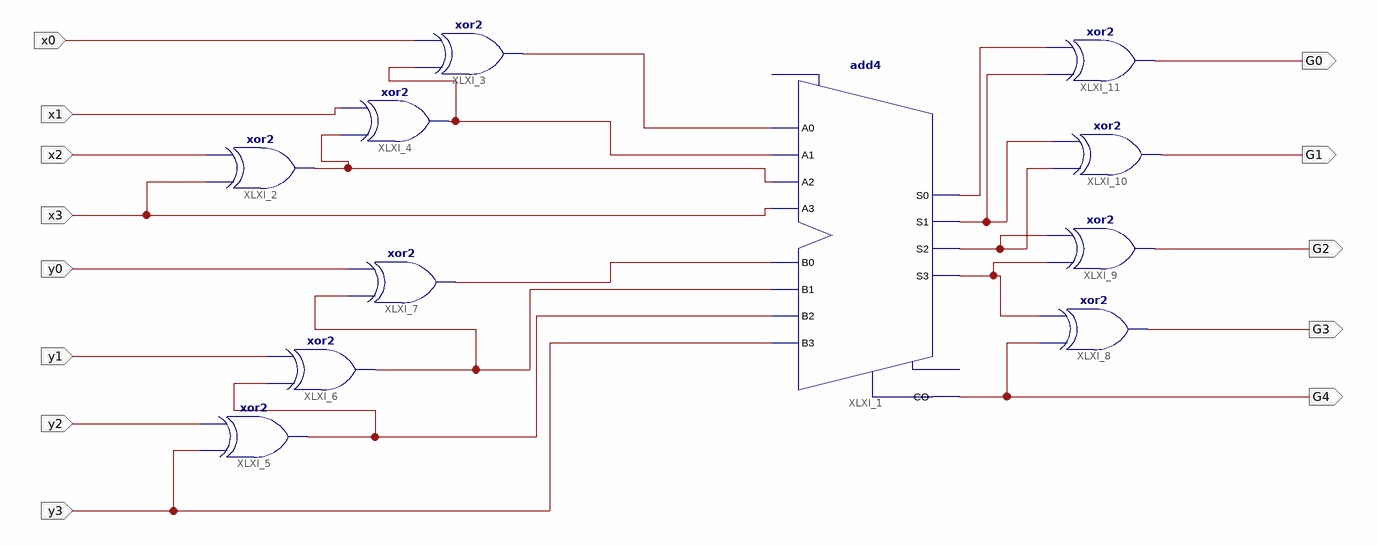
[diagram p0: schematic sheet 1]
// Xilinx ISE schematic gray_schemat.sch (artix7) as structural Verilog: 11 symbols, 13 ports
module gray_schemat (
  input  x3,
  input  x2,
  input  x1,
  input  x0,
  input  y3,
  input  y2,
  input  y1,
  input  y0,
  output G4,
  output G3,
  output G2,
  output G1,
  output G0
);

  wire XLXN_4, XLXN_14, XLXN_15, XLXN_28, XLXN_29, XLXN_31, XLXN_32, XLXN_38, XLXN_40, XLXN_41;

  add4 XLXI_1 (
    .A0(XLXN_4), .A1(XLXN_15), .A2(XLXN_14), .A3(x3), .B0(XLXN_41), .B1(XLXN_40), .B2(XLXN_38), .B3(y3),
    .CO(G4), .S0(XLXN_32), .S1(XLXN_31), .S2(XLXN_29), .S3(XLXN_28));  // open: CI, OFL
  xor XLXI_2 (XLXN_14, x3, x2);
  xor XLXI_3 (XLXN_4, XLXN_15, x0);
  xor XLXI_4 (XLXN_15, XLXN_14, x1);
  xor XLXI_5 (XLXN_38, y3, y2);
  xor XLXI_6 (XLXN_40, XLXN_38, y1);
  xor XLXI_7 (XLXN_41, XLXN_40, y0);
  xor XLXI_8 (G3, G4, XLXN_28);
  xor XLXI_9 (G2, XLXN_28, XLXN_29);
  xor XLXI_10 (G1, XLXN_29, XLXN_31);
  xor XLXI_11 (G0, XLXN_31, XLXN_32);
endmodule
